# EAGLE board tester (EAGLE 7.6.0)
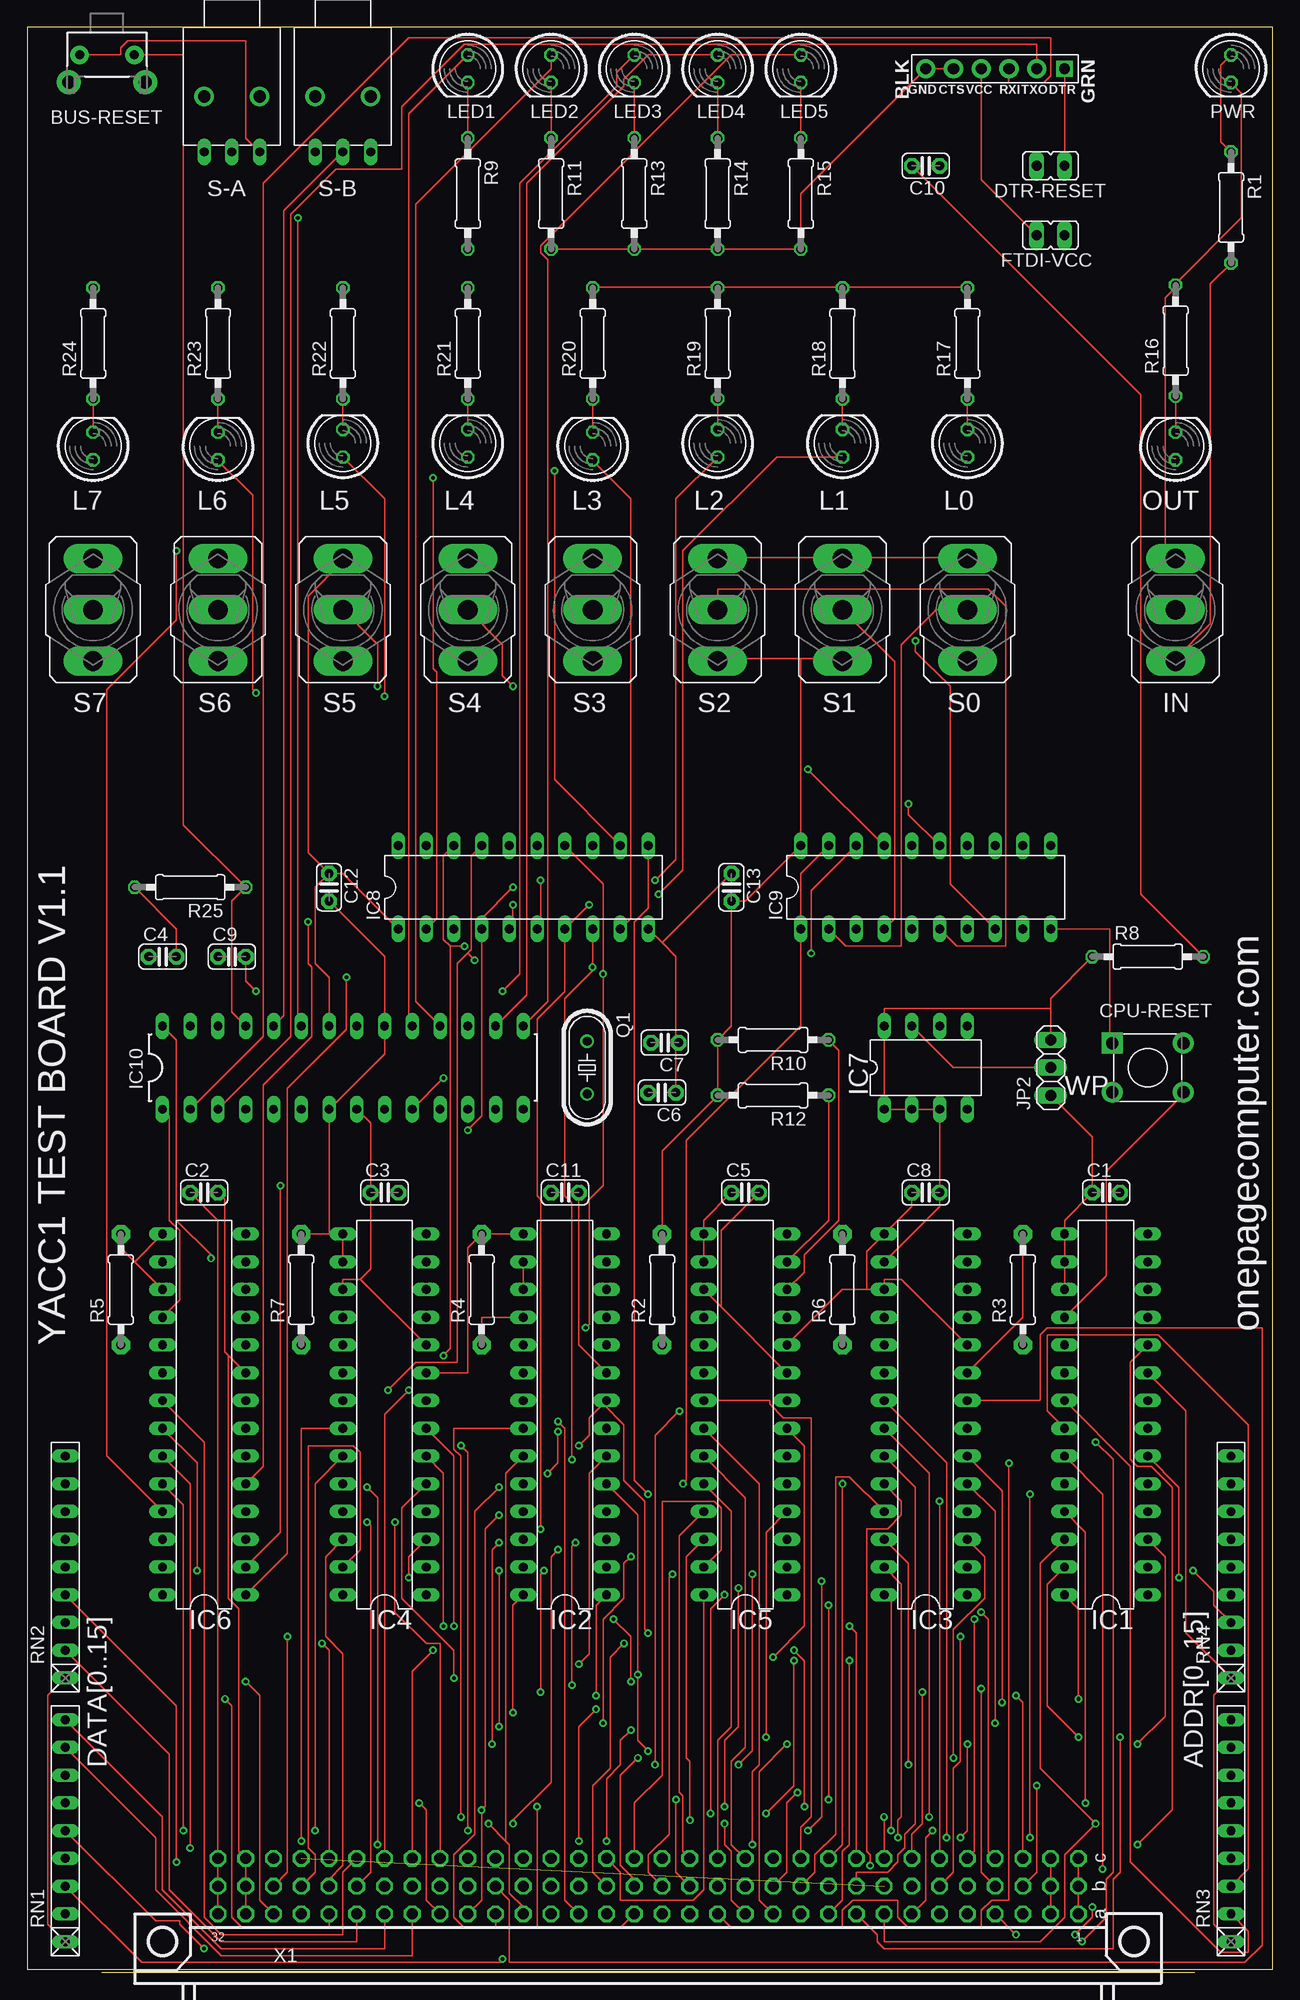
[diagram p4: board, top side]
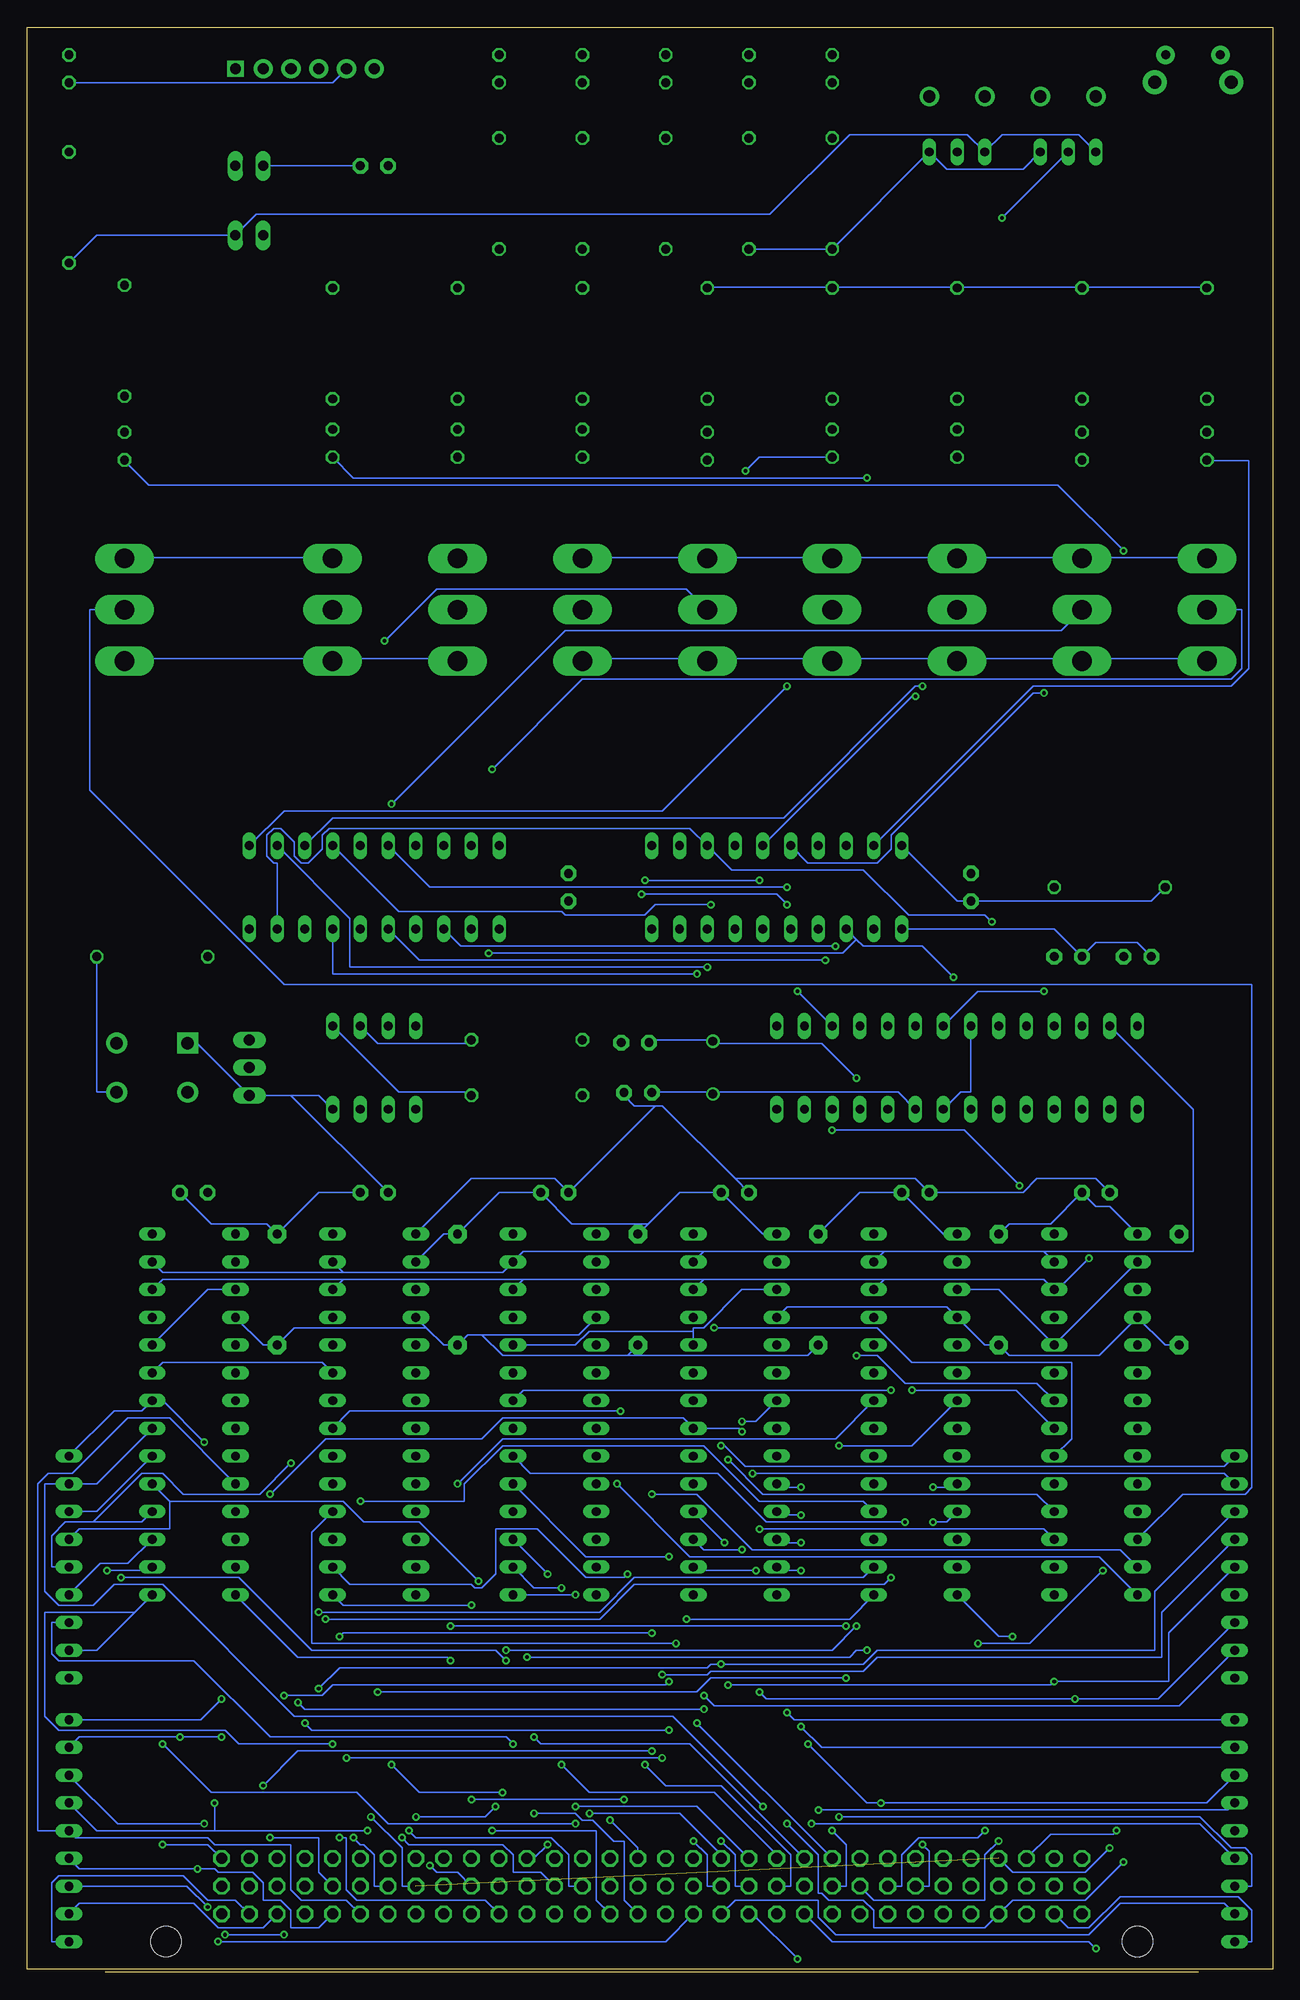
[diagram p5: board, bottom side, seen from below]

Size 113.97 x 177.78 mm. Coordinates in mm from the lower left corner, seen from the top.
Outline: 113.97,0 113.97,177.78 0,177.78 0,0 113.97,0
Copper layers (1*16): Top 0.0356mm / dielectric 1.5011mm / Bottom 0.0356mm
Design rules "LaenPCBOrder *": minimum track width 6mil, minimum drill 13mil, track to track 8mil, track to pad 8mil, pad to pad 8mil, via to via 8mil, smd to smd 6mil, copper to edge 15mil, drill to drill 6mil, minimum pad ring 7mil, minimum via ring 7mil, stop-mask expansion 3mil, vias tented up to drill 0mil, thermal gap 10mil

## Footprints (pad centres in the part's own frame; a part is rotated, then mirrored left to right if it is on the bottom)
TACTILE-PTH-SIDEEZ = drill 0.8 pad 1.7: 1 -2.5,0; 2 2.5,0 | drill 1.2 pad 2.2: ANCHOR1 -3.5,2.5; ANCHOR2 3.5,2.5
C025-024X044 = drill 0.813 pad 1.422 octagon: 1 -1.27,0; 2 1.27,0
SW4-6.2X6.2X5.0MM = drill 1.143 pad 1.905 square: 1 -3.25,2.25 | drill 1.143 pad 1.905: 2 -3.25,-2.25; 3 3.25,-2.25; 4 3.25,2.25
JP1 = drill 0.914 long: 1 0,-1.27; 2 0,1.27
DIL28-3 = drill 0.813 long: 1 -16.51,-3.81; 2 -13.97,-3.81; 3 -11.43,-3.81; 4 -8.89,-3.81; 5 -6.35,-3.81; 6 -3.81,-3.81; 7 -1.27,-3.81; 8 1.27,-3.81; 9 3.81,-3.81; 10 6.35,-3.81; 11 8.89,-3.81; 12 11.43,-3.81; 13 13.97,-3.81; 14 16.51,-3.81; 15 16.51,3.81; 16 13.97,3.81; 17 11.43,3.81; 18 8.89,3.81; 19 6.35,3.81; 20 3.81,3.81; 21 1.27,3.81; 22 -1.27,3.81; 23 -3.81,3.81; 24 -6.35,3.81; 25 -8.89,3.81; 26 -11.43,3.81; 27 -13.97,3.81; 28 -16.51,3.81
DIL8 = drill 0.813 long: 1 -3.81,-3.81; 2 -1.27,-3.81; 3 1.27,-3.81; 4 3.81,-3.81; 5 3.81,3.81; 6 1.27,3.81; 7 -1.27,3.81; 8 -3.81,3.81
DIL20 = drill 0.813 long: 1 -11.43,-3.81; 2 -8.89,-3.81; 3 -6.35,-3.81; 4 -3.81,-3.81; 5 -1.27,-3.81; 6 1.27,-3.81; 7 3.81,-3.81; 8 6.35,-3.81; 9 8.89,-3.81; 10 11.43,-3.81; 11 11.43,3.81; 12 8.89,3.81; 13 6.35,3.81; 14 3.81,3.81; 15 1.27,3.81; 16 -1.27,3.81; 17 -3.81,3.81; 18 -6.35,3.81; 19 -8.89,3.81; 20 -11.43,3.81
M9040P = drill 1.803 long: 1 0,4.699; 2 0,0; 3 0,-4.699
FTDI_DEVICE_SIDE = drill 1 square: P$1 -6.35,0 | drill 1.016 pad 1.778: P$2 -3.81,0; P$3 -1.27,0; P$4 1.27,0; P$5 3.81,0; P$6 6.35,0
1X03 = drill 1.016 long: 1 -2.54,0; 2 0,0; 3 2.54,0
LED5MM = drill 0.813 octagon: A -1.27,0; K 1.27,0
HC49/S = drill 0.813: 1 -2.413,0; 2 2.413,0
0207/10 = drill 0.813 octagon: 1 -5.08,0; 2 5.08,0
0207/10' = drill 0.813 pad 1.676 octagon: 1 -5.08,0; 2 5.08,0
RN-9 = drill 0.813 long: 1 -10.16,0; 2 -7.62,0; 3 -5.08,0; 4 -2.54,0; 5 0,0; 6 2.54,0; 7 5.08,0; 8 7.62,0; 9 10.16,0
9070-1W = drill 0.813 long: 1 5.08,-2.54; 2 5.08,0; 3 5.08,2.54 | drill 1.118 pad 1.778: B 0,-2.54; B1 0,2.54
FABC96R = drill 1.016 octagon: A1 -2.54,39.37; A2 -2.54,36.83; A3 -2.54,34.29; A4 -2.54,31.75; A5 -2.54,29.21; A6 -2.54,26.67; A7 -2.54,24.13; A8 -2.54,21.59; A9 -2.54,19.05; A10 -2.54,16.51; A11 -2.54,13.97; A12 -2.54,11.43; A13 -2.54,8.89; A14 -2.54,6.35; A15 -2.54,3.81; A16 -2.54,1.27; A17 -2.54,-1.27; A18 -2.54,-3.81; A19 -2.54,-6.35; A20 -2.54,-8.89; A21 -2.54,-11.43; A22 -2.54,-13.97; A23 -2.54,-16.51; A24 -2.54,-19.05; A25 -2.54,-21.59; A26 -2.54,-24.13; A27 -2.54,-26.67; A28 -2.54,-29.21; A29 -2.54,-31.75; A30 -2.54,-34.29; A31 -2.54,-36.83; A32 -2.54,-39.37; B1 -5.08,39.37; B2 -5.08,36.83; B3 -5.08,34.29; B4 -5.08,31.75; B5 -5.08,29.21; B6 -5.08,26.67; B7 -5.08,24.13; B8 -5.08,21.59; B9 -5.08,19.05; B10 -5.08,16.51; B11 -5.08,13.97; B12 -5.08,11.43; B13 -5.08,8.89; B14 -5.08,6.35; B15 -5.08,3.81; B16 -5.08,1.27; B17 -5.08,-1.27; B18 -5.08,-3.81; B19 -5.08,-6.35; B20 -5.08,-8.89; B21 -5.08,-11.43; B22 -5.08,-13.97; B23 -5.08,-16.51; B24 -5.08,-19.05; B25 -5.08,-21.59; B26 -5.08,-24.13; B27 -5.08,-26.67; B28 -5.08,-29.21; B29 -5.08,-31.75; B30 -5.08,-34.29; B31 -5.08,-36.83; B32 -5.08,-39.37; C1 -7.62,39.37; C2 -7.62,36.83; C3 -7.62,34.29; C4 -7.62,31.75; C5 -7.62,29.21; C6 -7.62,26.67; C7 -7.62,24.13; C8 -7.62,21.59; C9 -7.62,19.05; C10 -7.62,16.51; C11 -7.62,13.97; C12 -7.62,11.43; C13 -7.62,8.89; C14 -7.62,6.35; C15 -7.62,3.81; C16 -7.62,1.27; C17 -7.62,-1.27; C18 -7.62,-3.81; C19 -7.62,-6.35; C20 -7.62,-8.89; C21 -7.62,-11.43; C22 -7.62,-13.97; C23 -7.62,-16.51; C24 -7.62,-19.05; C25 -7.62,-21.59; C26 -7.62,-24.13; C27 -7.62,-26.67; C28 -7.62,-29.21; C29 -7.62,-31.75; C30 -7.62,-34.29; C31 -7.62,-36.83; C32 -7.62,-39.37 | hole 2.794: 0,-44.456; 0,44.456

## Placement (x,y rotation side)
BUS-RESET  SWITCH-MOMENTARY-2SIDE_EZ  [TACTILE-PTH-SIDEEZ]  7.29,175.26 180 top
C1  0.1  [C025-024X044]  98.73,71.12 0 top
C2  0.1  [C025-024X044]  16.18,71.12 0 top
C3  0.1  [C025-024X044]  32.69,71.12 0 top
C4  0.1  [C025-024X044]  12.37,92.71 0 top
C5  0.1  [C025-024X044]  65.71,71.12 0 top
C6  20pf  [C025-024X044]  58.09,80.26 180 top
C7  20pf  [C025-024X044]  58.34,84.84 180 top
C8  0.1  [C025-024X044]  82.22,71.12 0 top
C9  0.1  [C025-024X044]  18.72,92.71 0 top
C10  0.1  [C025-024X044]  82.22,165.1 180 top
C11  0.1  [C025-024X044]  49.2,71.12 0 top
C12  0.1  [C025-024X044]  27.61,99.06 270 top
C13  0.1  [C025-024X044]  64.44,99.06 270 top
CPU-RESET  TS-1109-7  [SW4-6.2X6.2X5.0MM]  102.54,82.55 0 top
DTR-RESET  [JP1]  93.65,165.1 90 top
FTDI-VCC  [JP1]  93.65,158.75 90 top
IC1  MCP23017SP  [DIL28-3]  98.73,50.8 90 top
IC2  MCP23017SP  [DIL28-3]  49.2,50.8 90 top
IC3  MCP23017SP  [DIL28-3]  82.22,50.8 90 top
IC4  MCP23017SP  [DIL28-3]  32.69,50.8 90 top
IC5  MCP23017SP  [DIL28-3]  65.71,50.8 90 top
IC6  MCP23017SP  [DIL28-3]  16.18,50.8 90 top
IC7  24AA01P  [DIL8]  82.22,82.55 0 top
IC8  74LS374N  [DIL20]  45.39,99.06 0 top
IC9  74LS244N  [DIL20]  82.22,99.06 0 top
IC10  ATMEGA328P_PDIP  [DIL28-3]  28.88,82.55 0 top
IN  [M9040P]  105.08,124.46 180 top
JP1  FTDI_DEVICE  [FTDI_DEVICE_SIDE]  88.57,173.99 180 top
JP2  [1X03]  93.65,82.55 90 top
L0  [LED5MM]  86.03,139.7 90 top
L1  [LED5MM]  74.6,139.7 90 top
L2  [LED5MM]  63.17,139.7 90 top
L3  [LED5MM]  51.74,139.45 90 top
L4  [LED5MM]  40.31,139.7 90 top
L5  [LED5MM]  28.88,139.7 90 top
L6  [LED5MM]  17.45,139.45 90 top
L7  [LED5MM]  6.02,139.45 90 top
LED1  [LED5MM]  40.31,173.99 270 top
LED2  [LED5MM]  47.93,173.99 270 top
LED3  [LED5MM]  55.55,173.99 270 top
LED4  [LED5MM]  63.17,173.99 270 top
LED5  [LED5MM]  70.79,173.99 270 top
OUT  [LED5MM]  105.08,139.45 90 top
PWR  [LED5MM]  110.16,173.99 270 top
Q1  16Mhz  [HC49/S]  51.23,82.55 270 top
R1  330  [0207/10]  110.16,161.29 270 top
R2  10k  [0207/10']  58.09,62.23 90 top
R3  10k  [0207/10']  91.11,62.23 90 top
R4  10k  [0207/10']  41.58,62.23 90 top
R5  10k  [0207/10']  8.56,62.23 90 top
R6  10k  [0207/10']  74.6,62.23 90 top
R7  10k  [0207/10']  25.07,62.23 90 top
R8  10k  [0207/10]  102.54,92.71 0 top
R9  330  [0207/10]  40.31,162.56 270 top
R10  2.2k  [0207/10]  68.25,85.09 180 top
R11  330  [0207/10]  47.93,162.56 270 top
R12  2.2k  [0207/10]  68.25,80.01 180 top
R13  330  [0207/10]  55.55,162.56 270 top
R14  330  [0207/10]  63.17,162.56 270 top
R15  330  [0207/10]  70.79,162.56 270 top
R16  330  [0207/10]  105.08,149.1 90 top
R17  330  [0207/10]  86.03,148.84 90 top
R18  330  [0207/10]  74.6,148.84 90 top
R19  330  [0207/10]  63.17,148.84 90 top
R20  330  [0207/10]  51.74,148.84 90 top
R21  330  [0207/10]  40.31,148.84 90 top
R22  330  [0207/10]  28.88,148.84 90 top
R23  330  [0207/10]  17.45,148.84 90 top
R24  330  [0207/10]  6.02,148.84 90 top
R25  10k  [0207/10]  14.91,99.06 180 top
RN1  [RN-9]  3.48,12.7 90 top
RN2  [RN-9]  3.48,36.83 90 top
RN3  [RN-9]  110.16,12.7 90 top
RN4  [RN-9]  110.16,36.83 90 top
S0  [M9040P]  86.03,124.46 180 top
S1  [M9040P]  74.6,124.46 180 top
S2  [M9040P]  63.17,124.46 180 top
S3  [M9040P]  51.74,124.46 180 top
S4  [M9040P]  40.31,124.46 180 top
S5  [M9040P]  28.88,124.46 180 top
S6  [M9040P]  17.45,124.46 180 top
S7  [M9040P]  6.02,124.46 180 top
S-A  [9070-1W]  18.72,171.45 270 top
S-B  [9070-1W]  28.88,171.45 270 top
X1  FABC96R  [FABC96R]  56.82,2.54 270 top

## Tracks (layer width: path | path; a pad name or v marks a point on that pad's centre or on a via)
-RESET
  Top 0.152: IC10.1 13.01,78.11 13.01,68.58 13.96,67.63 13.96,61.28 IC6.18 | IC2.18 41.58,59.69 R4.1 | C10.2 101.9,144.15 101.9,98.42 R8.2 | IC1.18 98.73,63.5 98.73,73.03 105.71,80.01 CPU-RESET.3
  Bottom 0.152: R5.1 9.83,57.15 IC6.18 15.86,56.2 24.12,56.2 R7.1 26.34,57.15 IC4.18 29.83,60.64 44.44,60.64 IC2.18 | IC1.18 92.38,57.15 R3.1 89.52,58.74 77.46,58.74 | IC5.18 63.49,58.1 72.38,58.1 | 72.38,58.1 73.65,58.1 R6.1 75.87,57.15 77.46,58.74 | 77.46,58.74 IC3.18 | 59.04,56.2 R2.1 | 59.04,56.2 70.47,56.2 72.38,58.1 | R4.1 42.53,56.2 59.04,56.2 | R8.2 107.62,80.33 106.03,80.33 CPU-RESET.3
AC-LD  (via drill 0.33)
  Top 0.152: v66.34,36.2 66.34,20 v65.08,18.73
  Bottom 0.152: v66.34,36.2 IC5.3 | v65.08,18.73 62.53,16.19 51.11,16.19 45.39,10.48 X1.C21
AC-LD-INV  (via drill 0.33)
  Top 0.152: v65.08,34.92 65.08,22.23 63.8,20.95 v63.8,14.92
  Bottom 0.152: IC5.2 67.61,34.92 v65.08,34.92 | v63.8,14.92 52.69,14.92 X1.C20
AC-RD  (via drill 0.33)
  Top 0.152: IC5.4 67.61,40 v67.61,21.27
  Bottom 0.152: v67.61,21.27 66.98,20.64 53.33,20.64 X1.C22
ADDR0
  Top 0.152: IC1.21 100.95,46.04 100.95,9.84 109.21,1.59 111.75,1.59 111.75,3.49 RN3.2
  Bottom 0.152: RN3.2 109.21,6.03 98.73,6.03 96.51,3.81 92.38,3.81 X1.A3
ADDR1  (via drill 0.33)
  Top 0.152: RN3.3 111.75,9.21 111.75,49.85 103.49,58.1 93.33,58.1 93.33,51.12 IC1.22 | v90.47,3.17 X1.A4 | v95.87,3.17 97.46,4.76 v97.46,5.71
  Bottom 0.152: v95.87,3.17 v90.47,3.17 | v97.46,5.71 99.36,7.62 RN3.3
ADDR2  (via drill 0.33)
  Top 0.152: IC1.23 98.41,43.5 v98.41,9.21
  Bottom 0.152: RN3.4 109.21,9.21 v98.41,9.21 96.83,9.21 96.51,8.89 93.33,8.89 92.38,7.94 92.38,6.35 90.79,6.35 89.84,5.4 89.84,3.81 87.3,3.81 X1.A5
ADDR3
  Bottom 0.152: IC1.24 100.95,50.48 104.76,50.48 109.84,45.4 112.07,45.4 113.02,44.45 113.02,12.7 RN3.5 109.52,12.06 97.46,12.06 96.83,11.43 89.84,11.43 89.84,7.3 88.89,6.35 84.76,6.35 X1.A6
ADDR4  (via drill 0.33)
  Top 0.152: v82.86,12.7 82.22,12.06 82.22,6.35 X1.A7 | IC1.25 96.83,40 v96.83,15.24
  Bottom 0.152: RN3.6 107.62,12.7 96.83,12.7 | v82.86,12.7 96.83,12.7 | 96.83,12.7 v96.83,15.24
ADDR5  (via drill 0.33)
  Top 0.152: X1.A8 78.41,2.54 92.7,2.54 94.92,4.76 94.92,10.48 v97.78,13.33 92.7,18.41 92.7,37.15 IC1.26
  Bottom 0.152: RN3.7 105.71,13.33 v97.78,13.33
ADDR6  (via drill 0.33)
  Top 0.152: v96.19,21.27 93.33,24.13 93.33,35.24 IC1.27 | X1.A9 77.78,3.17 77.78,2.54 78.41,1.9 99.36,1.9 99.36,8.25 100,8.89 v100,21.27
  Bottom 0.152: RN3.8 109.21,21.27 v100,21.27 v96.19,21.27
ADDR7  (via drill 0.33)
  Top 0.152: IC1.28 96.19,33.02 v96.19,24.77 | X1.A10 74.6,6.35 74.6,10.79 75.23,11.43 v75.23,28.26
  Bottom 0.152: v96.19,24.77 98.1,22.86 RN3.9 | v75.23,28.26 75.55,28.57 89.2,28.57 IC1.28
ADDR8  (via drill 0.33)
  Top 0.152: v85.39,12.06 86.03,12.7 v86.03,20.64
  Bottom 0.152: 104.13,32.7 107.62,29.21 RN4.2 | 104.13,32.7 IC1.1 | X1.A11 72.06,6.35 83.81,6.35 84.76,7.3 84.76,12.06 v85.39,12.06 | v86.03,20.64 94.6,20.64 95.87,21.91 111.11,21.91 112.38,23.18 112.38,32.7 104.13,32.7
ADDR9  (via drill 0.33)
  Top 0.152: v106.67,36.51 108.57,34.61 108.57,33.34 RN4.3 | X1.A12 66.98,6.35 66.98,18.1 v69.52,20.64
  Bottom 0.152: IC1.2 102.86,36.51 v106.67,36.51 | v69.52,20.64 70.16,21.27 91.75,21.27 98.73,28.26 111.11,28.26 111.75,28.89 111.75,31.75 RN4.3
ADDR10  (via drill 0.33)
  Top 0.152: X1.A13 64.44,6.35 64.44,10.79 63.8,11.43 v63.8,13.33 | v101.59,20.64 104.13,23.18 104.13,37.78 IC1.3
  Bottom 0.152: IC1.3 104.76,37.15 107.3,37.15 RN4.4 | v63.8,13.33 80.95,13.33 83.81,16.19 97.14,16.19 v101.59,20.64
ADDR11  (via drill 0.33)
  Top 0.152: X1.A14 64.44,3.81 74.6,3.81 74.6,5.4 75.55,6.35 79.68,6.35 79.68,4.76 80.63,3.81 87.3,3.81 87.3,5.4 88.25,6.35 89.84,6.35 v89.84,46.36
  Bottom 0.152: IC1.4 103.49,40.96 107.94,40.96 | 107.94,40.96 110.48,40.96 111.75,39.69 111.75,36.83 RN4.5 | v89.84,46.36 92.7,43.5 99.68,43.5 101.59,45.4 103.49,45.4 107.94,40.96
ADDR12  (via drill 0.33)
  Top 0.152: v71.42,12.7 72.69,13.97 v72.69,35.56
  Bottom 0.152: 100.95,42.86 IC1.5 | 100.95,42.86 100.95,40.32 109.21,40.32 RN4.6 | X1.A15 61.9,6.35 61.9,12.7 v71.42,12.7 | v72.69,35.56 78.09,40.96 83.17,40.96 85.08,42.86 100.95,42.86
ADDR13  (via drill 0.33)
  Top 0.152: v67.61,14.29 70.16,16.83 v70.16,28.26 | v105.4,35.88 105.4,44.13 IC1.6
  Bottom 0.152: IC1.6 107.62,41.91 RN4.7 | X1.A16 59.36,6.35 59.36,11.75 60.31,11.75 62.22,13.65 63.17,13.65 63.8,14.29 v67.61,14.29 | v70.16,28.26 71.11,29.21 87.94,29.21 94.6,35.88 v105.4,35.88
ADDR14  (via drill 0.33)
  Top 0.152: X1.A17 54.28,3.81 46.66,3.81 v46.66,14.92
  Bottom 0.152: IC1.7 107.62,44.45 RN4.8 112.38,44.45 112.38,34.61 111.11,33.34 107.94,33.34 106.03,35.24 101.59,35.24 89.52,23.18 54.92,23.18 v46.66,14.92
ADDR15  (via drill 0.33)
  Top 0.152: v96.51,2.54 98.73,4.76 98.73,8.25 99.36,8.89 99.36,46.67 v97.78,48.26
  Bottom 0.152: RN4.9 106.03,51.12 103.49,51.12 IC1.8 101.59,52.07 v97.78,48.26 | X1.A18 55.55,2.54 v96.51,2.54
ALU0  (via drill 0.33)
  Top 0.152: IC5.26 60.31,37.78 60.31,19.37 60.63,19.05 v60.63,13.65
  Bottom 0.152: v60.63,13.65 58.09,11.11 X1.C16
ALU1
  Top 0.152: IC5.27 63.49,38.42 63.49,42.23 62.85,42.86 58.09,42.86 58.09,17.78 55.55,15.24 X1.C17
ALU2
  Top 0.152: IC5.28 61.9,7.3 60.95,6.35 54.28,6.35 54.28,8.89 X1.C18
ALU3  (via drill 0.33)
  Top 0.152: v63.8,34.29 62.53,33.02 v62.53,14.29
  Bottom 0.152: v63.8,34.29 IC5.1 | v62.53,14.29 54.28,14.29 50.47,10.48 X1.C19
ALU-FUNC
  Top 0.152: IC5.25 59.68,39.69 59.68,16.19 60,15.88 60,10.79 X1.C15
ARD-RXIN
  Top 0.152: IC10.2 21.58,85.41 21.58,163.51 34.91,176.85 93.65,176.85 93.65,173.35 93.02,172.72 89.84,172.72 JP1.P$3
ARD-TXOUT
  Top 0.152: IC10.3 24.12,85.41 24.12,160.66 28.25,164.78 34.28,164.78 34.28,170.5 39.99,176.21 92.38,176.21 JP1.P$2
BIT0  (via drill 0.33)
  Top 0.152: IC6.1 23.8,38.1 23.8,80.64 29.2,86.04 v29.2,90.8 | IC9.18 71.74,98.74 v71.74,93.03
  Bottom 0.152: v29.2,90.8 32.05,93.66 37.45,93.66 38.09,94.3 | IC8.3 38.09,94.3 | v71.74,93.03 39.36,93.03 38.09,94.3
BIT1  (via drill 0.33)
  Top 0.152: IC6.2 23.16,40 v23.16,71.75 | v40.31,76.83 41.58,78.11 IC8.4 41.58,96.2 v44.44,99.06
  Bottom 0.152: v23.16,71.75 28.25,76.83 v40.31,76.83 | IC9.16 77.14,99.06 v44.44,99.06
BIT2  (via drill 0.33)
  Top 0.152: v46.98,40.32 46.98,70.48 46.66,70.8 46.66,87 49.2,89.53 IC8.7 v51.42,97.47
  Bottom 0.152: IC6.3 20.94,40.32 v46.98,40.32 | IC9.14 80,96.84 65.08,96.84 64.76,96.52 57.45,96.52 56.5,97.47 v51.42,97.47
BIT3  (via drill 0.33)
  Top 0.152: v49.83,46.67 49.83,70.17 49.2,70.8 49.2,88.9 51.74,91.44 v51.74,91.76 IC8.8
  Bottom 0.152: IC6.4 21.58,43.5 46.66,43.5 v49.83,46.67 | IC9.12 84.44,96.2 84.44,91.76 v51.74,91.76
BIT4  (via drill 0.33)
  Top 0.152: IC6.5 21.58,46.04 21.58,80.96 26.02,85.41 26.02,91.76 25.7,92.08 v25.7,95.89
  Bottom 0.152: v25.7,95.89 26.34,96.52 33.33,96.52 37.45,100.65 49.52,100.65 IC8.13 53.33,104.46 86.35,104.46 86.98,103.82 86.98,102.55 88.25,101.28 88.89,101.28 89.52,101.92 89.52,103.19 90.79,104.46 91.43,104.46 92.06,103.82 92.06,101.92 91.43,101.28 91.11,101.28 IC9.9
BIT5  (via drill 0.33)
  Top 0.152: v51.11,58.74 51.42,59.05 51.42,70.48 52.69,71.75 v52.69,91.12 52.69,99.38 IC8.14
  Bottom 0.152: IC6.6 18.4,48.58 18.4,55.56 33.01,55.56 36.18,58.74 v51.11,58.74 | IC9.7 86.03,91.12 v52.69,91.12
BIT6  (via drill 0.33)
  Top 0.152: v33.01,53.02 35.55,55.56 39.36,55.56 39.36,92.08 40.31,93.03 | 40.31,93.03 40.63,93.34 40.63,101.92 IC8.17 | 40.31,93.03 v40.94,92.39
  Bottom 0.152: IC6.7 23.48,53.02 v33.01,53.02 | IC9.5 78.09,92.39 v40.94,92.39
BIT7  (via drill 0.33)
  Top 0.152: v38.09,56.2 38.72,56.83 38.72,93.66 | 38.72,93.66 38.09,94.3 38.09,101.92 IC8.18 | 38.72,93.66 v39.99,93.66
  Bottom 0.152: IC6.8 21.58,53.66 33.64,53.66 36.18,56.2 v38.09,56.2 | IC9.3 74.28,93.66 v39.99,93.66
BR-COND  (via drill 0.33)
  Top 0.152: v33.64,40.96 33.64,32.7 36.5,29.84 37.77,29.84 X1.C24
  Bottom 0.152: IC5.6 67.93,45.4 50.79,45.4 46.34,40.96 v33.64,40.96
DATA0  (via drill 0.33)
  Top 0.152: v48.56,50.16 49.2,49.53 49.2,6.35 X1.A19
  Bottom 0.152: RN1.2 4.43,6.03 13.96,6.03 16.81,3.17 39.99,3.17 41.58,4.76 41.58,6.35 49.2,6.35 X1.A19 | IC2.21 47.3,50.16 v48.56,50.16
DATA1  (via drill 0.33)
  Top 0.152: RN1.3 10.46,0.63 43.48,0.63 v43.48,0.95 | IC2.22 39.04,49.53 39.04,47.62 39.67,46.99 v39.67,13.97
  Bottom 0.152: v43.48,0.95 47.61,5.08 X1.A20 | v39.67,13.97 6.66,13.97 3.8,11.11 2.53,11.11 1.89,10.48 1.89,7.62 RN1.3
DATA2  (via drill 0.33)
  Top 0.152: 43.8,11.75 44.12,11.43 44.12,6.98 45.39,5.71 X1.A21 | 43.8,11.75 v42.22,13.33 | IC2.23 43.8,45.4 43.8,11.75
  Bottom 0.152: RN1.4 6.66,13.33 v42.22,13.33
DATA3  (via drill 0.33)
  Top 0.152: RN1.5 11.73,4.45 13.96,4.45 13.96,4.13 v16.18,1.9 | v43.17,44.13 40.94,41.91 40.94,12.38 39.04,10.48 39.04,4.76 39.99,3.81 42.85,3.81 X1.A22
  Bottom 0.152: v16.18,1.9 16.81,2.54 40.31,2.54 X1.A22 | IC2.24 45.07,44.13 v43.17,44.13
DATA4  (via drill 0.33)
  Top 0.152: X1.A23 41.58,6.35 v41.58,14.6 41.9,14.92 41.9,40.32 v43.17,41.59
  Bottom 0.152: RN1.6 4.12,14.6 v41.58,14.6 | IC2.25 45.07,41.59 v43.17,41.59
DATA5  (via drill 0.33)
  Top 0.152: v35.86,15.24 36.5,14.6 36.5,6.35 X1.A24 | v43.17,39.05 42.53,38.42 v42.53,20.64
  Bottom 0.152: RN1.7 6.02,15.24 v35.86,15.24 37.14,15.24 v42.53,20.64 | IC2.26 45.07,39.05 v43.17,39.05
DATA6  (via drill 0.33)
  Top 0.152: RN1.8 11.73,12.06 11.73,7.3 17.77,1.27 35.23,1.27 X1.A25 | v43.17,22.23 v43.17,36.51
  Bottom 0.152: IC2.27 45.07,36.51 v43.17,36.51 | v43.17,22.23 41.26,20.32 RN1.8
DATA7  (via drill 0.33)
  Top 0.152: RN1.9 12.37,13.97 12.37,7.3 17.77,1.9 32.69,1.9 X1.A26 | IC2.28 44.44,33.34 v44.44,23.49
  Bottom 0.152: v44.44,23.49 43.8,22.86 RN1.9
DATA8  (via drill 0.33)
  Top 0.152: RN2.2 13.01,19.69 13.01,7.3 17.77,2.54 30.15,2.54 X1.A27 | IC2.1 52.06,33.34 v52.06,25.08
  Bottom 0.152: v52.06,25.08 51.11,24.13 8.56,24.13 RN2.2
DATA9  (via drill 0.33)
  Top 0.152: v18.09,24.77 18.72,24.13 18.72,4.76 19.67,3.81 27.61,3.81 X1.A28 | v47.3,36.51 46.98,36.2 v46.98,25.4
  Bottom 0.152: RN2.3 10.46,24.77 v18.09,24.77 46.34,24.77 v46.98,25.4 | IC2.2 52.69,36.51 v47.3,36.51
DATA10  (via drill 0.33)
  Top 0.152: RN2.4 13.64,24.13 v13.64,9.84 | v48.56,38.42 47.93,37.78 47.93,17.14 44.44,13.65 v44.44,13.33
  Bottom 0.152: v13.64,9.84 17.13,6.35 23.8,6.35 X1.A29 26.34,3.81 36.5,3.81 36.5,5.4 37.45,6.35 40.63,6.35 41.26,6.98 41.58,6.98 41.58,10.48 v44.44,13.33 | IC2.3 52.06,38.42 v48.56,38.42
DATA11  (via drill 0.33)
  Top 0.152: v19.99,26.35 21.26,25.08 21.26,6.35 X1.A30 | v50.15,39.05 49.83,38.73 v49.83,26.03
  Bottom 0.152: RN2.5 9.51,30.8 9.51,26.35 v19.99,26.35 20.31,26.03 v49.83,26.03 | v50.15,39.05 IC2.4
DATA12  (via drill 0.33)
  Top 0.152: IC2.5 55.87,41.59 v55.87,26.99 55.87,20.95 v56.82,20 | X1.B3 92.38,8.89 v92.38,16.83
  Bottom 0.152: RN2.6 10.15,32.7 10.15,28.57 36.18,28.57 37.45,27.3 51.42,27.3 51.74,26.99 v55.87,26.99 | v92.38,16.83 89.2,20 v56.82,20
DATA13  (via drill 0.33)
  Top 0.152: v50.47,27.94 51.42,28.89 51.42,45.4 IC2.6 | X1.B4 87.3,8.89 v87.3,25.72
  Bottom 0.152: RN2.7 10.78,34.61 10.78,29.21 36.18,29.21 37.45,27.94 v50.47,27.94 51.42,27.94 51.74,27.62 85.39,27.62 v87.3,25.72
DATA14  (via drill 0.33)
  Top 0.152: v47.61,45.4 48.56,46.36 v48.56,49.21 | v91.75,43.5 v91.75,12.06
  Bottom 0.152: RN2.8 4.43,45.4 v47.61,45.4 | v48.56,49.21 48.88,49.53 IC2.7 53.96,50.48 70.47,50.48 72.38,48.58 86.67,48.58 v91.75,43.5 | X1.B5 87.3,8.89 87.3,12.06 v91.75,12.06
DATA15  (via drill 0.33)
  Top 0.152: v50.47,47.94 51.42,48.89 51.42,50.48 52.69,51.75 | X1.B6 84.76,8.89 84.76,18.41 85.39,19.05 v85.39,30.48 | v56.82,30.8 56.5,31.12 56.5,42.86 54.6,44.77 54.6,49.85 52.69,51.75 | 52.69,51.75 IC2.8
  Bottom 0.152: RN2.9 4.43,46.04 48.25,46.04 50.15,47.94 v50.47,47.94 | v85.39,30.48 85.08,30.8 v56.82,30.8
GND  (via drill 0.33)
  Top 0.152: BUS-RESET.2 8.56,175.26 8.56,175.9 9.2,176.53 19.99,176.53 19.99,167.64 S-A.3 | JP1.P$5 JP1.P$6 70.79,162.56 R15.2 R14.2 R13.2 R11.2 | PWR.K 111.11,171.77 111.11,160.34 105.08,154.31 R16.2 105.08,153.99 104.13,153.03 104.13,130.18 105.08,129.22 IN.3 | 74.6,129.22 63.17,129.22 S2.3 | 74.6,129.22 86.03,129.22 S0.3 | 74.6,129.22 S1.3 | IC8.1 28.88,100.33 C12.1 | 30.47,63.18 IC4.10 | 30.47,63.18 28.88,63.18 IC4.17 | X1.A32 X1.B32 X1.C32 17.45,68.58 C2.1 | IC10.8 31.42,77.47 C3.1 31.42,64.14 30.47,63.18 | C12.1 26.34,99.06 26.34,92.08 27.61,90.8 IC10.22 | 58.09,93.98 59.36,92.71 59.36,85.09 C7.1 59.36,84.77 C6.1 | 58.09,93.98 IC8.10 | 58.09,93.98 C13.1 | IC5.16 IC5.15 61.9,68.58 C5.1 | IC2.17 IC2.16 | C8.1 80.95,69.85 IC3.15 76.82,65.72 76.82,62.23 | IC5.10 74.6,62.23 76.82,62.23 | 76.82,62.23 IC3.17 78.41,63.18 80,63.18 IC3.10 | IC9.10 99.05,95.25 99.05,85.09 CPU-RESET.1 | X1.A1 X1.B1 X1.C1 | v101.59,11.43 104.76,14.6 104.76,44.13 102.86,46.04 101.59,46.04 100.95,46.67 100.95,55.56 IC1.10 | IC1.17 IC1.16 IC1.15 94.92,68.58 C1.1 97.46,76.2 JP2.1 | C12.1 25.7,102.23 25.7,125.73 28.88,128.91 S5.3
  Bottom 0.152: S-A.3 22.85,164.78 29.83,164.78 S-B.3 R9.2 R11.2 | 17.45,129.22 6.02,129.22 S7.3 | 17.45,129.22 28.88,129.22 | 17.45,129.22 S6.3 | 28.88,129.22 40.31,129.22 | 28.88,129.22 S5.3 | 40.31,129.22 51.74,129.22 | 40.31,129.22 S4.3 | IN.3 105.08,129.22 86.03,129.22 S0.3 | 51.74,129.22 63.17,129.22 S2.3 | 51.74,129.22 S3.3 | JP1.P$5 86.03,172.72 PWR.K | C4.1 12.37,93.98 16.18,93.98 C9.1 19.99,95.25 IC8.1 | IC6.16 IC6.10 25.07,62.23 IC4.17 | IC10.22 27.61,80.33 28.56,80.33 IC10.8 | C2.1 16.18,72.39 21.58,72.39 22.85,71.12 C3.1 32.69,72.39 49.2,72.39 | 49.2,72.39 55.87,79.06 56.5,79.06 | 49.2,72.39 C11.1 | 56.5,79.06 58.41,79.06 59.36,80.01 C6.1 | 56.5,79.06 C5.1 65.71,72.39 73.33,72.39 IC3.15 | 53.01,58.42 53.01,58.74 52.06,58.74 48.56,62.23 IC2.17 | 53.01,58.42 IC2.10 | 53.01,58.42 62.53,58.42 63.8,57.15 IC5.10 | IC7.4 87.3,80.01 89.84,80.01 | 89.84,80.01 JP2.1 98.41,84.77 99.05,84.77 CPU-RESET.1 | IC1.10 97.46,62.23 IC1.17 | X1.C1 97.46,11.43 v101.59,11.43 | 89.84,80.01 C8.1
H/L-SWAP  (via drill 0.33)
  Top 0.152: IC5.7 71.11,47.94 71.11,31.43 v68.25,28.57 | v37.14,29.21 35.23,27.3 X1.C25
  Bottom 0.152: v68.25,28.57 38.72,28.57 38.09,29.21 v37.14,29.21
I/D-REG-DN  (via drill 0.33)
  Top 0.152: IC4.3 34.91,37.78 v34.91,35.88 | v86.67,32.07 86.67,10.79 X1.C5
  Bottom 0.152: v34.91,35.88 35.55,35.24 58.41,35.24 61.58,32.07 v86.67,32.07
I/D-REG-LD  (via drill 0.33)
  Top 0.152: v53.64,32.07 55.23,30.48 v55.23,26.35 | v90.47,25.08 91.11,24.45 X1.C3
  Bottom 0.152: IC4.1 38.72,32.07 v53.64,32.07 | v55.23,26.35 55.55,26.03 86.03,26.03 86.98,25.08 v90.47,25.08
I/D-REG-RD  (via drill 0.33)
  Top 0.152: v87.3,32.7 87.94,32.07 87.94,10.79 X1.C4
  Bottom 0.152: IC4.2 37.45,35.88 58.41,35.88 61.58,32.7 v87.3,32.7
I/D-REG-UP  (via drill 0.33)
  Top 0.152: X1.C6 v83.49,42.86
  Bottom 0.152: IC4.4 37.45,42.86 46.98,42.86 52.06,47.94 70.47,47.94 73.97,44.45 73.97,42.86 v83.49,42.86
I/O-ADDR
  Top 0.152: IC4.26 27.29,37.78 27.29,30.48 28.88,28.89 28.88,9.52 27.61,8.25 X1.B28
I/O-RD  (via drill 0.33)
  Top 0.152: v31.1,40.96 31.42,40.64 31.42,8.89 X1.B27
  Bottom 0.152: IC4.25 29.83,40.96 v31.1,40.96
I/O-WR  (via drill 0.33)
  Top 0.152: v31.1,44.13 32.05,43.18 v32.05,11.43
  Bottom 0.152: IC4.24 29.2,44.13 v31.1,44.13 | v32.05,11.43 31.42,10.79 31.42,7.62 X1.B26
IN  (via drill 0.33)
  Top 0.152: v34.91,53.02 32.69,50.8 X1.C26
  Bottom 0.152: IC5.8 68.57,53.02 v34.91,53.02
IN-SWITCH
  Bottom 0.152: IC6.26 8.24,43.5 2.53,43.5 1.89,44.13 1.89,90.17 90.47,90.17 108.26,107.95 108.26,124.46 IN.2
INT
  Top 0.152: IC4.27 30.47,38.42 30.47,47.31 29.83,47.94 25.7,47.94 25.7,11.11 26.34,10.48 26.34,8.89 X1.B29
INTA  (via drill 0.33)
  Top 0.152: v23.8,30.48 23.8,8.89 X1.B30
  Bottom 0.152: IC4.28 25.07,30.48 v23.8,30.48
LEDS-LD  (via drill 0.33)
  Top 0.152: v56.82,43.5 55.55,44.77 55.55,95.89 56.82,97.16 IC8.11
  Bottom 0.152: IC6.27 13.96,38.42 47.61,38.42 52.69,43.5 v56.82,43.5
MEM-RD  (via drill 0.33)
  Top 0.152: IC4.23 26.34,44.45 v26.34,12.7
  Bottom 0.152: v26.34,12.7 26.98,12.06 32.37,12.06 33.96,10.48 33.96,7.62 X1.B25
MEM-WR  (via drill 0.33)
  Top 0.152: IC4.22 25.07,49.53 v25.07,11.75
  Bottom 0.152: v25.07,11.75 26.34,10.48 26.34,6.35 36.5,6.35 X1.B24
N$1
  Top 0.152: IC10.19 34.91,86.68 34.91,169.86 LED1.A
N$2
  Top 0.152: IC7.7 84.76,82.55 JP2.2
N$3
  Bottom 0.152: IC10.9 34.28,80.33 51.11,80.33 Q1.2 51.42,80.33 56.82,80.33 C6.2
N$4  (via drill 0.33)
  Top 0.152: v38.09,81.6 IC10.10
  Bottom 0.152: v38.09,81.6 41.26,84.77 51.11,84.77 Q1.1 51.42,85.09 56.82,85.09 C7.2
N$5
  Top 0.152: R1.1 109.21,167.32 109.21,174.31 PWR.A
N$6
  Top 0.152: IC10.18 35.55,88.58 35.55,161.61 47.93,173.99 LED2.A
N$7  (via drill 0.33)
  Top 0.152: v43.48,89.53 45.07,91.12 45.07,163.51 53.96,172.4 53.96,173.67 LED3.A
  Bottom 0.152: v43.48,89.53 IC10.17
N$8
  Top 0.152: IC10.16 45.71,89.22 45.71,163.51 54.6,172.4 54.6,173.04 56.82,175.26 LED4.A
N$9
  Bottom 0.152: C10.1 DTR-RESET.2
N$10
  Top 0.152: IC10.15 47.61,88.58 47.61,156.53 46.98,157.16 46.98,157.8 64.44,175.26 LED5.A
N$11
  Top 0.152: LED2.K R11.1
N$12
  Top 0.152: LED1.K R9.1
N$13
  Top 0.152: LED3.K R13.1
N$14  (via drill 0.33)
  Top 0.152: v20.94,89.53 19.99,90.49 C9.2
  Bottom 0.152: IC10.21 26.98,89.53 v20.94,89.53
N$15
  Top 0.152: LED4.K R14.1
N$16
  Top 0.152: LED5.K R15.1
N$17
  Top 0.152: R24.1 L7.K
N$18  (via drill 0.33)
  Top 0.152: IC10.23 24.75,86.68 v24.75,160.34
  Bottom 0.152: S-A.2 v24.75,160.34
N$19
  Top 0.152: IC10.24 23.48,87.31 23.48,160.97 S-B.2
N$20
  Top 0.152: R23.1 L6.K
N$21
  Top 0.152: R22.1 L5.K
N$22
  Top 0.152: R21.1 L4.K
N$23
  Top 0.152: R20.1 L3.K
N$24
  Top 0.152: R19.1 L2.K
N$25
  Top 0.152: R18.1 L1.K
N$26
  Top 0.152: R17.1 L0.K
N$27
  Top 0.152: R16.1 OUT.K
N$28
  Top 0.152: JP1.P$1 DTR-RESET.1
N$29
  Top 0.152: FTDI-VCC.2 87.3,163.83 JP1.P$4
N$30
  Top 0.152: 63.17,153.99 51.74,153.99 R20.2 | 63.17,153.99 74.6,153.99 | 63.17,153.99 R19.2 | 74.6,153.99 86.03,153.99 R17.2 | 74.6,153.99 R18.2
  Bottom 0.152: 17.45,153.99 6.02,153.99 R24.2 | 17.45,153.99 28.88,153.99 | 17.45,153.99 R23.2 | 28.88,153.99 40.31,153.99 | 28.88,153.99 R22.2 | 40.31,153.99 51.74,153.99 R20.2 | 40.31,153.99 R21.2
N$31  (via drill 0.33)
  Top 0.152: IC8.5 44.44,95.57 v44.44,97.47 | v57.77,98.42 60,100.65 60,129.86 68.57,138.43 L1.A
  Bottom 0.152: v44.44,97.47 45.39,98.42 v57.77,98.42
N$32
  Top 0.152: IC8.9 55.23,96.2 55.23,134.62 51.74,138.11 L3.A
N$33  (via drill 0.33)
  Top 0.152: IC8.12 48.25,108.9 v48.25,137.16
  Bottom 0.152: v48.25,137.16 46.98,138.43 L4.A
N$34  (via drill 0.33)
  Top 0.152: v32.69,116.52 32.69,134.62 L5.A
  Bottom 0.152: IC8.15 33.01,116.52 v32.69,116.52
N$35  (via drill 0.33)
  Top 0.152: IC8.6 46.98,95.57 v46.98,99.69 | v57.45,99.69 59.36,101.6 59.36,134.62 L2.A
  Bottom 0.152: v57.45,99.69 v46.98,99.69
N$36  (via drill 0.33)
  Top 0.152: v20.94,116.84 20.62,117.16 20.62,134.94 17.45,138.11 L6.A
  Bottom 0.152: IC8.16 42.53,101.28 36.18,101.28 34.91,102.55 34.91,103.82 21.89,116.84 v20.94,116.84
N$37
  Bottom 0.152: IC8.19 21.89,117.47 3.8,117.47 2.21,119.06 2.21,138.11 6.02,138.11 L7.A
N$38  (via drill 0.33)
  Top 0.152: IC8.2 37.45,96.2 37.45,118.75 37.14,119.06 v37.14,136.53
  Bottom 0.152: v37.14,136.53 84.12,136.53 L0.A
N$39
  Top 0.152: IC10.25 18.72,87.63 18.72,97.79 R25.1 14.27,104.78 14.27,175.26 BUS-RESET.1
N$40
  Top 0.152: IC9.2 74.92,93.66 80,93.66 80,121.28 83.17,124.46 S0.2
N$41  (via drill 0.33)
  Top 0.152: IC9.8 84.44,99.38 84.44,117.47 81.27,120.65 v81.27,121.6
  Bottom 0.152: v81.27,121.6 76.5,126.37 53.64,126.37 S3.2
N$42
  Top 0.152: IC9.6 85.08,93.66 89.52,93.66 89.52,124.78 87.94,126.37 63.17,126.37 S2.2
N$43
  Top 0.152: IC9.4 79.36,96.2 79.36,119.7 S1.2
N$44  (via drill 0.33)
  Top 0.152: v44.44,117.47 43.48,118.43 43.48,121.28 S4.2
  Bottom 0.152: IC9.11 90.47,106.05 55.87,106.05 v44.44,117.47
N$45  (via drill 0.33)
  Top 0.152: v71.42,109.86 IC9.17
  Bottom 0.152: v71.42,109.86 63.17,118.11 3.8,118.11 2.84,119.06 2.84,124.46 S7.2
N$46  (via drill 0.33)
  Top 0.152: v32.05,117.47 32.05,121.28 S5.2
  Bottom 0.152: IC9.13 86.03,105.41 44.75,105.41 32.69,117.47 v32.05,117.47
N$47  (via drill 0.33)
  Top 0.152: IC9.15 80.63,105.73 v80.63,106.68
  Bottom 0.152: v80.63,106.68 64.76,122.56 19.35,122.56 S6.2
OUT
  Top 0.152: IC6.21 16.18,48.26 16.18,4.76 17.77,3.17 28.88,3.17 28.88,8.89 X1.C27
OUT-LED  (via drill 0.33)
  Top 0.152: IC6.25 7.29,46.99 7.29,117.16 13.64,123.51 v13.64,129.86
  Bottom 0.152: v13.64,129.86 19.67,135.89 102.86,135.89 105.08,138.11 OUT.A
REG-BRD-LD-ID  (via drill 0.33)
  Top 0.152: v59.04,36.2 58.72,35.88 58.72,12.38 56.82,10.48 56.82,8.89 X1.B16
  Bottom 0.152: IC3.2 84.44,35.24 73.33,35.24 73.01,34.92 72.38,34.92 71.11,36.2 71.11,40.32 67.3,40.32 62.85,35.88 59.36,35.88 v59.04,36.2
REG-BRD-RD-ID  (via drill 0.33)
  Top 0.152: IC3.26 80.63,37.15 v80.63,18.73 | v70.47,16.19 69.52,15.24 69.52,8.89 X1.B12
  Bottom 0.152: v80.63,18.73 78.09,16.19 v70.47,16.19
REG-FUNC  (via drill 0.33)
  Top 0.152: IC3.21 84.12,46.36 v84.12,12.06
  Bottom 0.152: v84.12,12.06 83.49,11.43 83.17,11.43 82.22,10.48 82.22,7.62 X1.B7
REG-LD-HI  (via drill 0.33)
  Top 0.152: v39.67,47.94 40.31,47.31 v40.31,12.7
  Bottom 0.152: IC4.21 33.01,47.94 v39.67,47.94 | v40.31,12.7 39.04,11.43 39.04,7.62 X1.B23
REG-LD-ID0  (via drill 0.33)
  Top 0.152: IC3.3 87.62,37.78 87.62,33.97 84.76,31.12 v84.76,19.37 | v55.87,19.37 54.28,17.78 54.28,9.52 55.55,8.25 X1.B17
  Bottom 0.152: v55.87,19.37 v84.76,19.37
REG-LD-ID1  (via drill 0.33)
  Top 0.152: v54.6,29.84 53.33,28.57 53.33,18.41 51.74,16.83 51.74,8.89 X1.B18
  Bottom 0.152: IC3.4 87.94,40 87.94,29.84 v54.6,29.84
REG-LD-ID2  (via drill 0.33)
  Top 0.152: IC3.5 88.57,41.91 v88.57,22.54 | v55.23,21.91 54.28,20.95 54.28,18.73 53.01,17.46 v53.01,11.75
  Bottom 0.152: v88.57,22.54 87.94,21.91 v55.23,21.91 | v53.01,11.75 51.74,10.48 51.74,7.62 X1.B19
REG-LD-LO  (via drill 0.33)
  Top 0.152: v59.68,51.12 57.45,48.89 v57.45,18.73
  Bottom 0.152: IC3.7 84.44,51.12 v59.68,51.12 | v57.45,18.73 55.55,16.83 50.47,16.83 44.12,10.48 44.12,7.62 X1.B21
REG-RD-HI
  Top 0.152: IC3.8 92.7,52.07 92.7,58.1 93.33,58.74 113.02,58.74 113.02,2.22 111.43,0.63 44.12,0.63 44.12,6.35 X1.B22
REG-RD-ID0  (via drill 0.33)
  Top 0.152: IC3.27 80,35.24 80,13.97 79.68,13.65 v79.68,12.06
  Bottom 0.152: v79.68,12.06 79.05,11.43 70.47,11.43 69.52,10.48 69.52,8.89 66.98,8.89 X1.B13
REG-RD-ID1  (via drill 0.33)
  Top 0.152: IC3.28 79.05,33.66 v79.05,12.7
  Bottom 0.152: v79.05,12.7 78.41,12.06 66.03,12.06 64.44,10.48 64.44,7.62 X1.B14
REG-RD-ID2  (via drill 0.33)
  Top 0.152: v73.33,15.56 v73.33,33.34 | v59.36,15.56 59.36,8.89 X1.B15
  Bottom 0.152: IC3.1 85.08,33.34 v73.33,33.34 | v59.36,15.56 v73.33,15.56
REG-RD-LO  (via drill 0.33)
  Top 0.152: IC3.6 89.2,43.81 v89.2,24.45 | v52.06,23.81 50.47,22.23 v50.47,11.75
  Bottom 0.152: v89.2,24.45 88.57,23.81 v52.06,23.81 | v50.47,11.75 49.2,10.48 49.2,7.62 X1.B20
RESET  (via drill 0.33)
  Top 0.152: IC6.24 14.27,42.55 v14.27,12.7
  Bottom 0.152: v14.27,12.7 14.59,12.38 20.31,12.38 X1.C30
SCL  (via drill 0.33)
  Top 0.152: IC10.28 13.64,85.09 13.64,68.58 16.81,65.41 v16.81,65.09 | R10.1 74.28,84.14 74.28,68.58 71.11,65.41 71.11,63.82 IC5.12
  Bottom 0.152: R10.1 73.65,84.77 81.9,84.77 IC7.6 | 35.55,63.18 20.94,63.18 IC6.12 19.67,62.23 v16.81,65.09 | IC4.12 35.55,63.18 | 52.06,63.18 IC2.12 | 35.55,63.18 52.06,63.18 | 68.57,63.18 IC5.12 | 52.06,63.18 68.57,63.18 | 85.08,63.18 IC3.12 | 68.57,63.18 85.08,63.18 | IC1.12 101.59,63.18 85.08,63.18
SDA
  Top 0.152: IC5.13 73.33,68.58 R12.1
  Bottom 0.152: 85.08,63.82 IC3.13 | 85.08,63.82 70.47,63.82 IC5.13 68.57,65.72 52.06,65.72 | IC1.13 101.59,63.82 85.08,63.82 | IC7.5 80,80.33 73.65,80.33 R12.1 | 20.94,65.72 IC6.13 | 35.55,65.72 20.94,65.72 | IC4.13 35.55,65.72 | 52.06,65.72 IC2.13 | 35.55,65.72 52.06,65.72 | IC10.27 7.29,78.74 7.29,65.72 20.94,65.72
SP/PC-ADDR-RD  (via drill 0.33)
  Top 0.152: v74.6,44.45 74.6,11.43 X1.C10
  Bottom 0.152: IC4.8 39.99,48.58 70.47,48.58 v74.6,44.45
SP/PC-DATA-RD-HI  (via drill 0.33)
  Top 0.152: IC4.7 39.04,46.99 v39.04,31.43 | v75.23,31.43 75.87,30.8 X1.C9
  Bottom 0.152: v75.23,31.43 v39.04,31.43
SP/PC-DATA-RD-LO  (via drill 0.33)
  Top 0.152: IC4.6 38.09,45.4 v38.09,31.43 | v70.16,29.21 71.11,28.26 v71.11,14.92 | X1.C8 v78.41,13.97
  Bottom 0.152: v38.09,31.43 40.31,29.21 v70.16,29.21 | v71.11,14.92 72.06,13.97 v78.41,13.97
SP/PC-DN
  Top 0.152: IC5.23 65.71,43.18 65.71,20.32 64.44,19.05 64.44,11.43 X1.C13
SP/PC-LD-HI  (via drill 0.33)
  Top 0.152: IC5.22 66.98,44.45 66.98,18.73 66.34,18.1 v66.34,11.43
  Bottom 0.152: v66.34,11.43 67.61,10.16 X1.C12
SP/PC-LD-LO
  Top 0.152: IC5.21 67.93,52.07 67.93,51.75 69.2,50.48 71.74,50.48 71.74,13.97 70.79,13.02 X1.C11
SP/PC-SEL  (via drill 0.33)
  Top 0.152: IC4.5 34.28,42.23 34.28,33.97 39.04,29.21 v39.04,26.67 | v81.9,25.4 81.9,13.33 80.95,12.38 X1.C7
  Bottom 0.152: v39.04,26.67 51.42,26.67 52.69,25.4 v81.9,25.4
SP/PC-UP
  Top 0.152: IC5.24 64.44,41.91 64.44,22.23 63.17,20.95 X1.C14
SR-LD  (via drill 0.33)
  Top 0.152: v55.23,37.78 54.6,37.15 54.6,33.97 52.69,32.07 v52.69,22.54
  Bottom 0.152: IC5.5 62.85,37.78 v55.23,37.78 | X1.C23 v52.69,22.54
SWITCHES-RD  (via drill 0.33)
  Top 0.152: v60,44.45 60.31,44.77 60.31,75.88 70.79,86.36 IC9.1 70.79,100.33 IC9.19
  Bottom 0.152: IC6.28 15.86,37.78 53.33,37.78 v60,44.45
UNUSED1  (via drill 0.33)
  Top 0.152: IC6.22 15.55,46.36 v15.55,36.51 | v26.98,29.84 27.61,29.21 X1.C28
  Bottom 0.152: v15.55,36.51 22.21,29.84 v26.98,29.84
UNUSED2  (via drill 0.33)  (1 unrouted)
  Top 0.152: IC6.23 14.91,44.45 v14.91,11.11 | IC3.22 82.54,45.4 v82.54,13.97
  Bottom 0.152: v14.91,11.11 17.13,8.89 23.8,8.89 X1.C29 | v82.54,13.97 79.68,11.11 79.68,7.62 X1.B8
UNUSED3
  Top 0.152: IC3.23 81.27,44.13 81.27,13.33 80.31,12.38 80.31,11.11 79.68,10.48 79.68,9.84 78.73,8.89 75.87,8.89 X1.B9
UNUSED4  (via drill 0.33)
  Top 0.152: IC3.24 80,42.86 80,41.59 78.73,40.32 76.82,40.32 76.82,10.79 77.14,10.48 v77.14,9.52
  Bottom 0.152: v77.14,9.52 76.5,8.89 74.6,8.89 X1.B10
UNUSED5
  Top 0.152: IC3.25 75.23,45.09 73.97,45.09 73.97,12.38 72.06,10.48 72.06,8.89 X1.B11
VCC
  Top 0.152: 70.79,120.01 74.6,120.01 S1.1 | 70.79,120.01 63.17,120.01 S2.1 | R1.2 108.26,154.31 108.26,123.19 105.08,120.01 IN.1 | X1.A2 X1.B2 X1.C2 | RN3.1 108.57,4.13 108.57,25.08 RN4.1 106.03,30.8 106.03,51.12 IC1.9 | IC3.9 91.11,59.69 R3.2 | R8.1 93.65,88.9 93.65,87.95 | JP2.3 93.65,87.95 | IC3.16 83.49,69.85 C8.2 IC7.3 IC7.2 IC7.1 IC7.8 78.41,87.95 93.65,87.95 | IC5.9 63.49,60.64 | 63.49,60.64 IC5.17 | C5.2 63.49,67.63 63.49,60.64 | IC2.9 50.47,57.15 C11.2 | R2.2 58.09,74.93 R12.2 R10.2 64.44,86.36 C13.2 65.71,97.79 IC9.20 70.79,120.01 | X1.A31 X1.B31 X1.C31 19.35,10.79 19.35,33.02 18.4,33.97 18.4,56.2 | RN1.1 1.89,4.13 1.89,25.08 RN2.1 | R25.2 13.64,95.25 C4.2 | 9.83,64.77 8.56,66.04 R5.2 | 9.83,64.77 IC6.17 | 9.83,64.77 IC6.15 | 18.4,56.2 18.09,56.52 18.09,70.48 C2.2 | 18.4,56.2 IC6.9 | IC4.9 40.31,54.61 40.31,66.04 R4.2 IC2.15 | IC4.16 IC4.15 27.61,67.31 | 27.61,67.31 R7.2 | 27.61,67.31 IC10.7 32.69,83.82 IC10.20 32.69,92.71 C12.2
  Bottom 0.152: S-A.1 17.77,167.96 24.75,167.96 S-B.1 27.93,167.96 38.72,167.96 46.03,160.66 93.02,160.66 FTDI-VCC.1 107.62,158.75 R1.2 | 86.03,120.01 74.6,120.01 S1.1 | 86.03,120.01 105.08,120.01 IN.1 | 86.03,120.01 S0.1 | 17.45,120.01 6.02,120.01 S7.1 | 17.45,120.01 28.88,120.01 | 17.45,120.01 S6.1 | 28.88,120.01 40.31,120.01 | 28.88,120.01 S5.1 | 40.31,120.01 51.74,120.01 | 40.31,120.01 S4.1 | 51.74,120.01 63.17,120.01 S2.1 | 51.74,120.01 S3.1 | X1.A2 94.92,6.35 97.46,6.35 99.68,8.57 111.11,8.57 111.75,7.94 111.75,2.54 RN3.1 | IC1.9 101.59,55.56 86.98,55.56 IC3.9 | C1.2 97.14,68.26 92.06,68.26 R3.2 87.3,71.12 C8.2 | IC3.16 75.87,67.31 R6.2 70.79,71.12 C5.2 64.12,68.26 57.14,68.26 | 57.14,68.26 54.28,71.12 C11.2 46.66,67.31 IC2.15 | 57.14,68.26 R2.2 | X1.A31 18.72,3.81 16.81,3.81 13.96,6.67 3.16,6.67 1.89,5.4 1.89,2.54 RN1.1 | IC8.20 28.88,97.79 C12.2 11.1,97.79 R25.2 | IC6.15 14.91,69.85 16.18,69.85 C2.2 20.31,68.26 24.12,68.26 R7.2 | IC4.15 30.15,67.31 C3.2 37.77,71.12 R4.2

## Text on the board
tNames: WP | onepagecomputer.com | YACC1 TEST BOARD V1.1 | DATA[0..15] | ADDR[0..15]